# Altium schematic sheet Voltage Regulator.SchDoc
size A
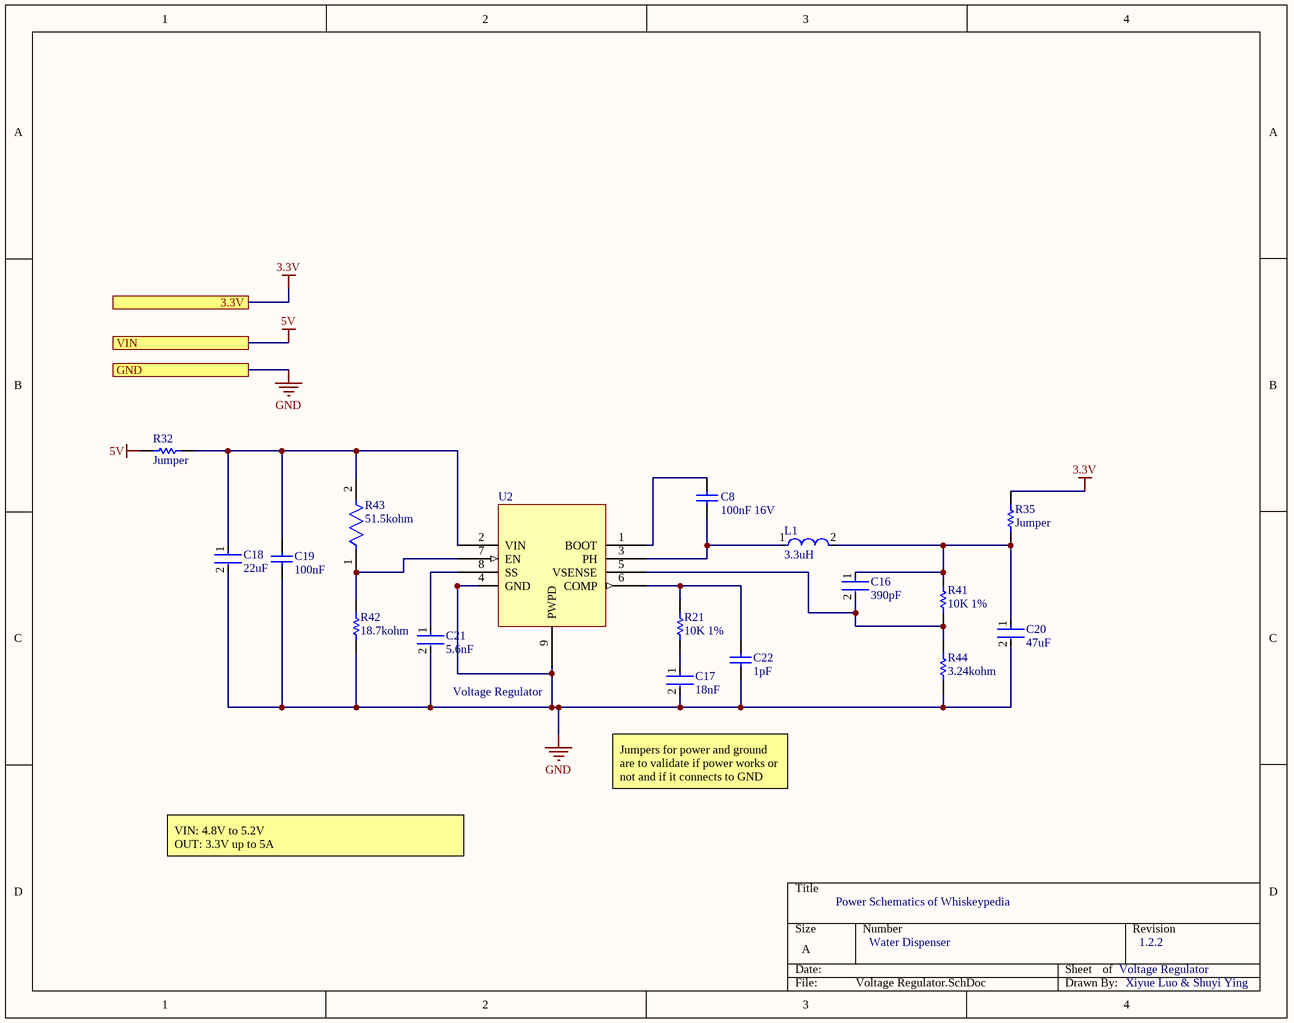
[diagram p0: Voltage Regulator.SchDoc]

## Parts
C8  100nF 16V  [CAPC0603(1608)100_N]
C16  390pF  [FP-CC0603-DA-MFG]
C17  18nF  [FP-GRM21B-0_1-IPC_A]
C18  22uF  [FP-GRM21B-0_2-e0_2_0_7-IPC_C]
C19  100nF  [CAPC1005X55X25NL05T10]
C20  47uF  [FP-GRM31C-0_2-e0_3_0_8-IPC_C]
C21  5.6nF  [FP-CGA4J-IPC_B]
C22  1pF  [CAPC1005X55X25NL05T10]
L1  3.3uH  [FP-SRN8040-MFG]
R21  10K 1%  [RESC0603(1608)_N]
R32  Jumper  [RESC0805(2012)_N]
R35  Jumper  [RESC0805(2012)_N]
R41  10K 1%  [RESC0603(1608)_N]
R42  18.7kohm  [RESC1608X55X30LL15T15]
R43  51.5kohm  [FP-CRCW0603-HPe3-IPC_B]
R44  3.24kohm  [RESC1608X55X30ML15T15]
U2  Voltage Regulator  [TPS5432DDAR]

## Ports
3.3V, GND, VIN

## Nets
3.3V: R35.2 ; port 3.3V
5V: R32.1 ; port VIN
GND: C17.2 C18.2 C19.1 C20.2 C21.2 C22.1 R42.1 R44.1 U2.4(GND) U2.9(PWPD) ; port GND
NetC8_1: C8.1 L1.1 U2.3(PH)
NetC8_2: C8.2 U2.1(BOOT)
NetC16_1: C16.1 C20.1 L1.2 R35.1 R41.2
NetC16_2: C16.2 R41.1 R44.2 U2.5(VSENSE)
NetC17_1: C17.1 R21.1
NetC18_1: C18.1 C19.2 R32.2 R43.2 U2.2(VIN)
NetC21_1: C21.1 U2.8(SS)
NetC22_2: C22.2 R21.2 U2.6(COMP)
NetR42_2: R42.2 R43.1 U2.7(EN)

## Notes on the sheet
- Jumpers for power and ground are to validate if power works or not and if it connects to GND
- VIN: 4.8V to 5.2V
  OUT: 3.3V up to 5A
- Power Schematics of Whiskeypedia
- Water Dispenser
- Voltage Regulator
- 1.2.2
- Xiyue Luo & Shuyi Ying

## Library data of the parts
C8 = CMP-1035-02584-1: CAP 100nF 16V ±10% 0603 (1608 Metric) Thickness 1mm SMD; Tolerance: Â±10%; Case-EIA: 0603; Case-Metric: 1608; Technology: SMT; Max Thickness: 1 mm; Value: 100nF; Rated Voltage: 16 V
C16 = CMP-03422-000674-1: CAP CER 390PF 50V X7R 0603; Manufacturer: YAGEO; Manufacturer Part Number: CC0603KRX7R9BB391; Tolerance: 0.1; Temperature Coefficient: 15%; Material: Ceramic; Device Class L1: Passive Components; Height: 0.9mm; RoHS: TRUE; Octopart: https://octopart.com/cc0603krx7r9bb391-yageo-39467837; Device Class L3: Ceramic Capacitors; ComponentLink2Description: Datasheet; Category: Cap; Digikey Description: CAP CER 390PF 50V X7R 0603; Device Class L2: Capacitors; Voltage: 50 V; Temperature Range Low: -55°C; Temperature: -55°C to +125°C; Temperature Range High: +125°C; Temperature Characteristic: X7R; ComponentLink2URL: http://www.yageo.com/documents/recent/UPY-GPHC_X7R_6.3V-to-50V_18.pdf; Package: CC0603-DA; Mouser Description: 0603 390 pF 50 V ±10 % Tolerance X7R SMT Multilayer Ceramic Capacitor; Lead Free: Yes; Footprint Url: http://www.yageo.com/exep/pages/download/literatures/UPY-C_GEN_24.pdf; Automotive: No; Value: 390 pF; Voltage Rating: 50 V; Capacitance: 390 pF
C17 = CMP-2007-03491-2: Chip Multilayer Ceramic Capacitors for General Purpose, 0805, 18000pF, C0G, 30ppm/°C, 5%, 50V; Packaging: Tape and Reel; Case/Package: 0805; Package Quantity: 10000; Termination: SMD/SMT; Case Code (Imperial): 0805; Thickness: 0.053inch; Dielectric: C0G; Tolerance: 5%; Max Operating Temperature: 125°C; Voltage Rating: 50V; Min Operating Temperature: -55°C; Capacitance: 18nF; Width: 0.049inch; Voltage Rating (DC): 50V; Depth: 1.25mm; Radiation Hardening: No; Height: 1.25mm; Mount: Surface Mount; Length: 2mm; Case Code (Metric): 2012
C18 = CMP-06035-039918-1: Chip Multilayer Ceramic Capacitors for General Purpose, 0805, 22uF, X5R, 15%, 20%, 10V; Dissipation Factor: 0.035%; Min Operating Temperature: -55°C; Voltage Rating (DC): 10V; Height: 1.25mm; Depth: 1.25mm; Max Operating Temperature: 85°C; Width: 1.25mm; Lead Free: Lead Free; Dielectric Material: Ceramic; Weight: 0.000335oz; Tolerance: 20%; Voltage Rating: 10V; Case Code (Metric): 2012; Termination: SMD/SMT; Length: 2mm; Thickness: 0.057inch; Case/Package: 0805; Packaging: Tape and Reel; Voltage: 10V; Case Code (Imperial): 0805; Resistor Type: Ceramic; Package Quantity: 3000; Mount: Surface Mount; Capacitance: 22uF; Dielectric: X5R
C19 = CMP-2008-04586-1: Part Number: GRM155R70J104KA01D; Manufacturer: Murata
C20 = CMP-2000-06344-2: Chip Multilayer Ceramic Capacitors for General Purpose, 1206, 47uF, X5R, 15%, 20%, 6.3V; Package Quantity: 2000; Mount: Surface Mount; Length: 3.2mm; Thickness: 0.071inch; Lead Free: Lead Free; Tolerance: 20%; Width: 0.063inch; Depth: 1.6mm; Case/Package: 1206; Dielectric: X5R; Radiation Hardening: No; Packaging: Tape and Reel; Voltage Rating (DC): 6.3V; Termination: SMD/SMT; Height: 1.6mm; Max Operating Temperature: 85°C; Case Code (Metric): 3216; Case Code (Imperial): 1206; Voltage: 6.3V; Voltage Rating: 6.3V; Capacitance: 47uF; Min Operating Temperature: -55°C; Material: Ceramic; REACH SVHC: No SVHC
C21 = CMP-08246-002383-1: Cap Ceramic 5.6nF 50V C0G 5% Pad SMD 0805 +125°C Automotive T/R; Max Operating Temperature: 125°C; Width: 0.049inch; Ratings: AEC-Q200; Voltage Rating: 50V; Dielectric: C0G; Capacitance: 5.6nF; Length: 2mm; Min Operating Temperature: -55°C; Packaging: Tape and Reel; Thickness: 0.028inch; Mount: Surface Mount; Case/Package: 0805; Composition: Ceramic; Voltage Rating (DC): 50V; Case Code (Metric): 2012; REACH SVHC: No SVHC; Package Quantity: 1; Height: 0.6mm; Tolerance: 5%; Termination: SMD/SMT; Weight: 0.000194oz; Depth: 1.25mm; Case Code (Imperial): 0805
C22 = CMP-2008-04277-1: Part Number: GRM1555C1H1R0CA01D; Manufacturer: Murata
L1 = CMP-07248-000074-1: FIXED IND 3.3UH 5.6A 21 MOHM SMD; Tolerance: 30%; Shielding: Shielded; DC Resistance (DCR): 21mR; Self Resonant Frequency: 34MHz; Material: Steel; Saturation Current: 5.5A; Sample Rate (Hz): 100kHz; Core Material: Ferrite; Depth: 8.3mm; Inductance: 3.3uH; Current Rating: 5.6A; DC Current: 5.6A; Max Operating Temperature: 125°C; REACH SVHC: No SVHC; Package Quantity: 1000; Resistor Type: Wirewound; RoHS Compliant: Yes; Width: 8mm; Case/Package: Nonstandard; Height: 4mm; Min Operating Temperature: -40°C; Number of Pins: 2; Series: SRN8040; RMS Current (Irms): 5.6A; Mount: Surface Mount; Military Standard: Not; Max DC Current: 5.6A; Termination: SMD/SMT; Packaging: Tape and Reel; Test Frequency: 100kHz; Height - Seated (Max): 0.157inch; Length: 8mm; Inductance Tolerance: 30%
R21 R41 = CMP-1012-00623-1: 10K 0.1W 1% 0603 (1608 Metric)  SMD; Value: 10000.00 Ohm; Case-EIA: 0603; Case-Metric: 1608; Power: 0.1 W; Tolerance: 1 %; Technology: SMT
R32 R35 = CMP-1013-00001-1: Jumper 0805 (2012 Metric); Case-EIA: 0805; Value: 0.00 Ohm; Tolerance: None; Case-Metric: 2012; Technology: SMT; Power: None
R42 = CMP-2000-00304-1: Part Number: ERJ-3EKF1872V; Manufacturer: Panasonic
R43 = CMP-02407-012018-1: RES Thick Film, 51.1kΩ, 1%, 0.33W, 100ppm/°C, 0603; Power Rating: 250mW; Voltage Rating: 75V; Resistance: 51.1kR; Weight: 7.1E-05oz; Lead Free: Lead Free; Termination: SMD/SMT; Resistor Type: Thick Film; Packaging: Tape and Reel; Max Operating Temperature: 155°C; Min Operating Temperature: -55°C; Temperature Coefficient: 100ppm/°C; Features: Automotive AEC-Q200; Case/Package: 0603; Height: 0.022inch; Number of Terminations: 2; Length: 0.063inch; Width: 0.033inch; Case Code (Imperial): 0603; Series: CRCW-HP; RoHS Compliant: Yes; Max Power Dissipation: 250mW; Tolerance: 1%; Case Code (Metric): 1608; Package Quantity: 5000
R44 = CMP-2000-00432-1: Part Number: ERJ-3EKF3241V; Manufacturer: Panasonic
U2 = TPS5432DDAR: TPS5432 2.95V to 6V Input, 3A Sy; Manufacturer: Texas Instruments; Switching Frequency: 700kHz; Output Voltage: 4.5V; Number of Outputs: 1; Synchronous Rectifier: Yes; Quiescent Current: 360uA; Output Type: Adjustable; Supplier 1: Digi-Key; Supplier Part Number 1: 296-30316-1-ND; Manufacturer Part Number: TPS5432DDAR; RoHS: Yes; Category: Voltage Regulators - Switching; Stock 1: 3364; Pricing 1: 1=0.92000, 10=0.80800, 25=0.75920, 100=0.61950, 250=0.57544, 500=0.48972, 1000=0.40425 (USD); Mount: Surface Mount; Case/Package: HSOP; Number of Pins: 8; Min Operating Temperature: -40°C; Max Operating Temperature: 125°C; Output Current: 3A; Min Input Voltage: 2.95V; Packaging: Tape and Reel; Package Quantity: 1; Max Output Current: 3A; Max Input Voltage: 6V; Operating Supply Voltage: 6V; Series: -; Radiation Hardening: No; Lead Free: Lead Free; RoHS Compliant: Yes; ComponentLink1URL: https://datasheet.ciiva.com/4905/slvsb89-121419-4905890.pdf?src-supplier=Mouser; ComponentLink1Description: https://datasheet.ciiva.com/4905/slvsb89-121419-4905890.pdf?src-supplier=Mouser; ComponentLink2URL: https://datasheet.ciiva.com/15268/tps5432-15268021.pdf?src-supplier=Arrow+Europe; ComponentLink2Description: https://datasheet.ciiva.com/15268/tps5432-15268021.pdf?src-supplier=Arrow+Europe; ComponentLink3URL: https://datasheet.ciiva.com/3221/tps5432-3221580.pdf?src-supplier=Avnet; ComponentLink3Description: https://datasheet.ciiva.com/3221/tps5432-3221580.pdf?src-supplier=Avnet; ComponentLink4URL: https://datasheet.ciiva.com/6597/tps5432-6597980.pdf?src-supplier=Digi-Key; ComponentLink4Description: https://datasheet.ciiva.com/6597/tps5432-6597980.pdf?src-supplier=Digi-Key; ComponentLink5URL: https://datasheet.ciiva.com/6597/tps5432-6597982.pdf?src-supplier=Digi-Key; ComponentLink5Description: https://datasheet.ciiva.com/6597/tps5432-6597982.pdf?src-supplier=Digi-Key